# Altium schematic sheet 显示与输入.SchDoc
size A3
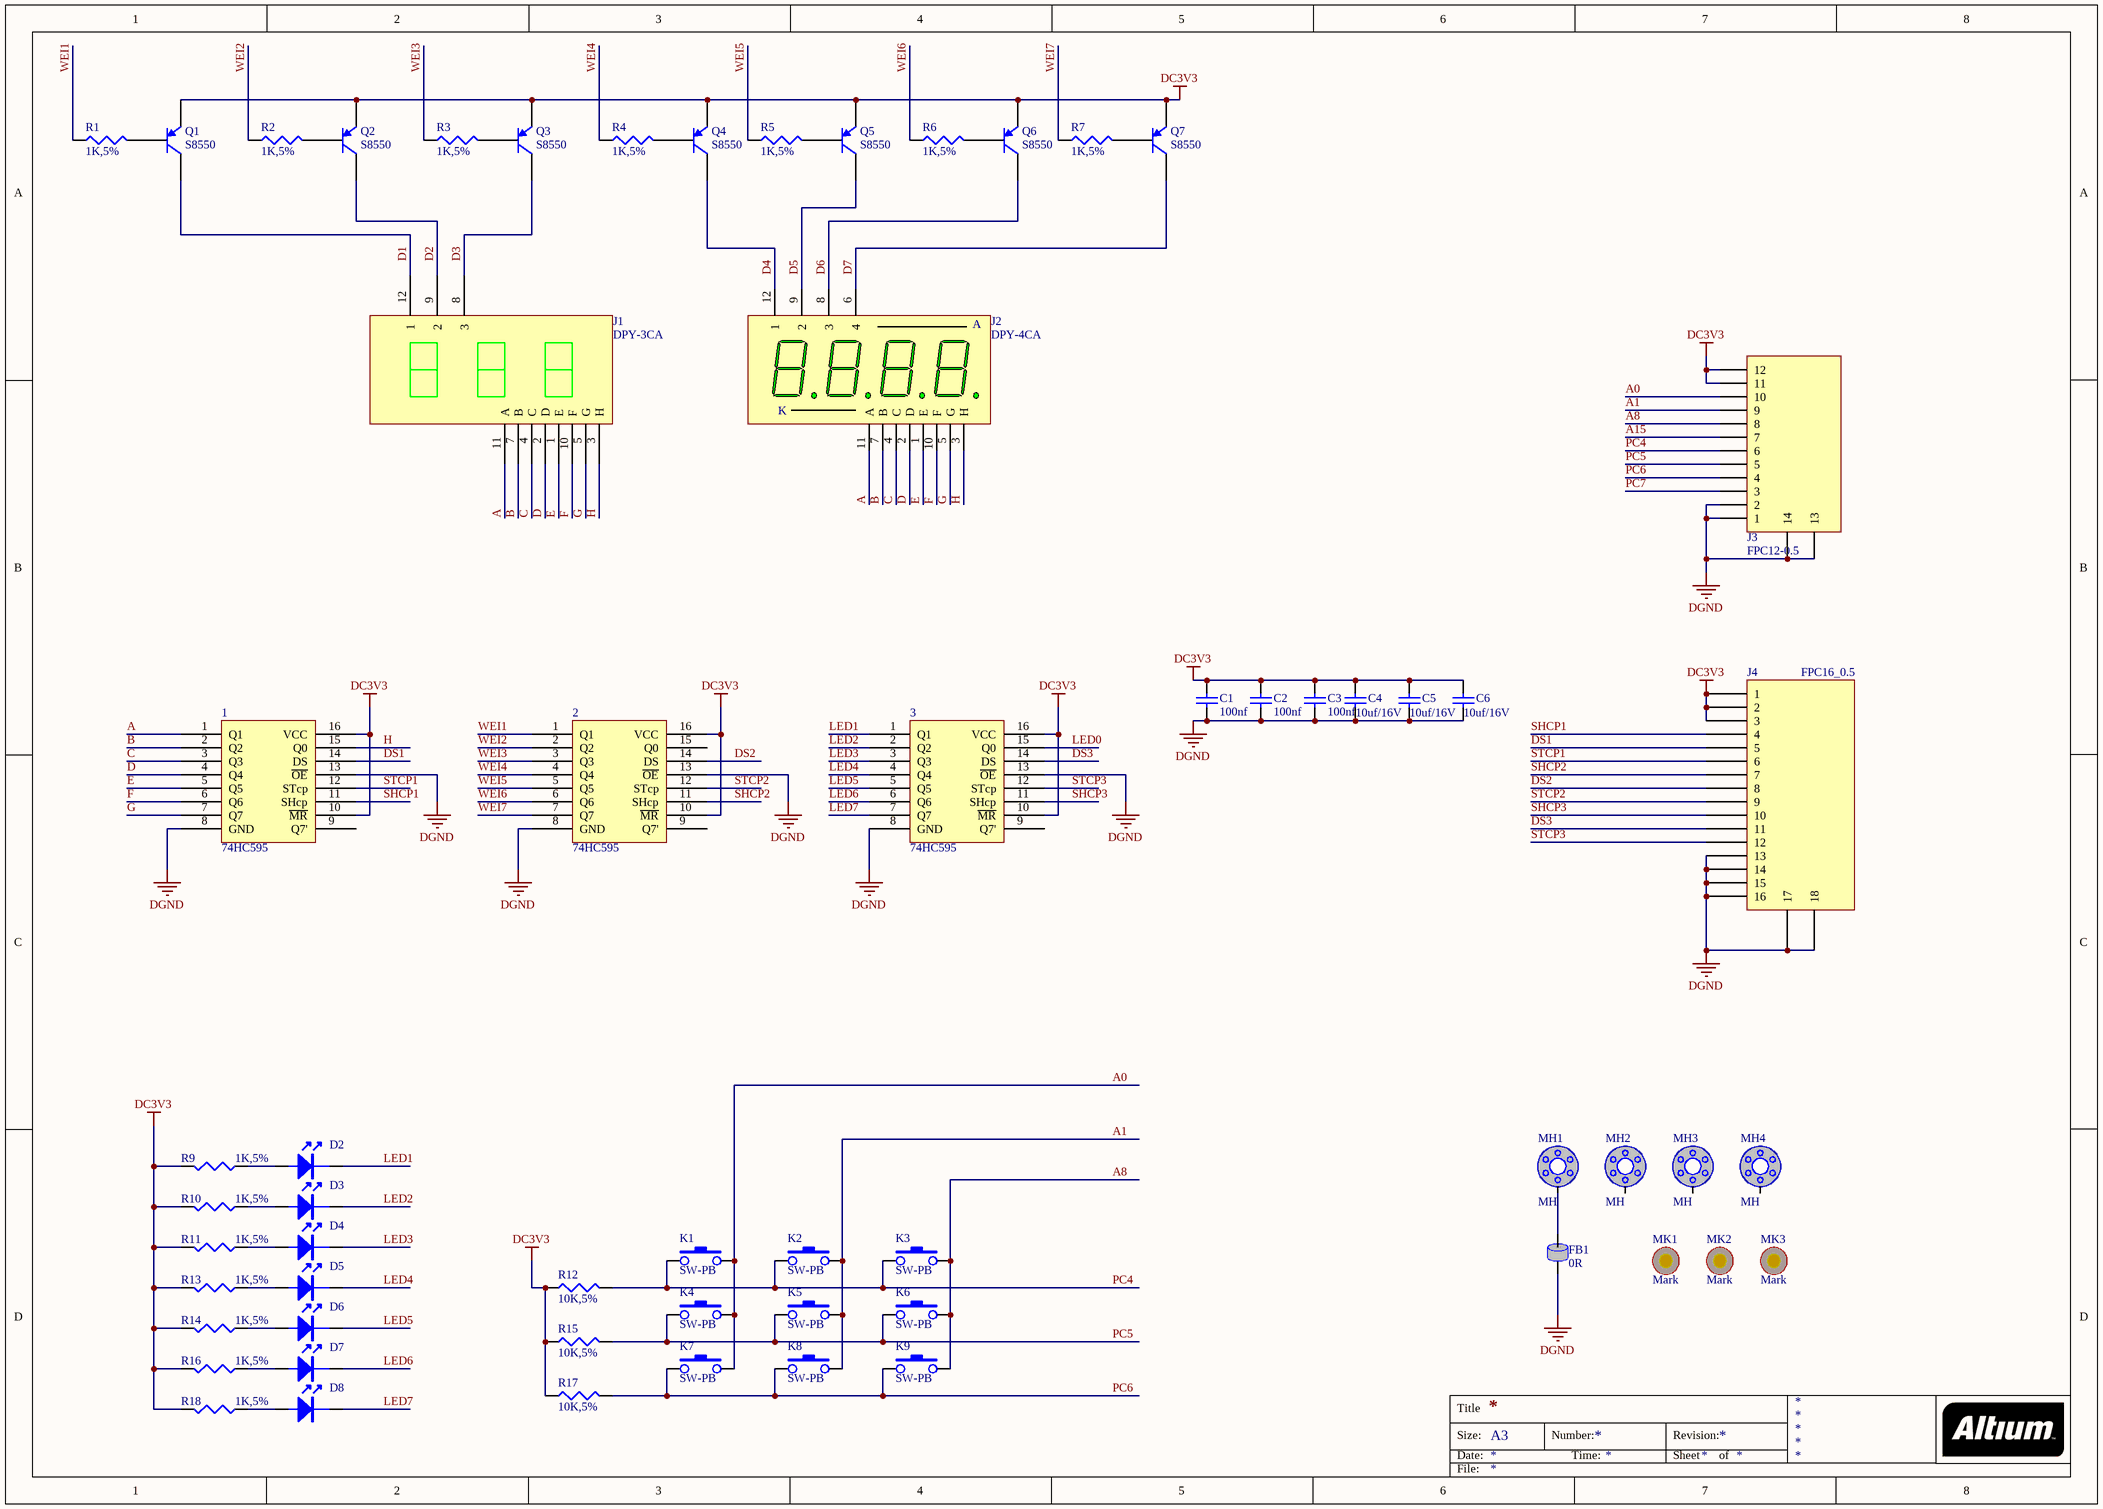
[diagram p0: 显示与输入.SchDoc]

## Parts
1  74HC595  [SOIC-16]
2  74HC595  [SOIC-16]
3  74HC595  [SOIC-16]
C1  100nf  [Cap0603]
C2  100nf  [Cap0603]
C3  100nf  [Cap0603]
C4  10uf/16V  [Cap0603]
C5  10uf/16V  [Cap0603]
C6  10uf/16V  [Cap0603]
D2  LED  [LED0603]  (value not drawn)
D3  LED  [LED0603]  (value not drawn)
D4  LED  [LED0603]  (value not drawn)
D5  LED  [LED0603]  (value not drawn)
D6  LED  [LED0603]  (value not drawn)
D7  LED  [LED0603]  (value not drawn)
D8  LED  [LED0603]  (value not drawn)
FB1  0R  [FB0603]
J1  DPY-3CA  [3位数码管0.56寸]
J2  DPY-4CA  [4位数码管0.56寸]
J3  FPC12-0.5  [FPC0.5-12P]
J4  FPC16_0.5  [FPC0.5-16P]
K1  SW-PB  [PCB-KEY]
K2  SW-PB  [PCB-KEY]
K3  SW-PB  [PCB-KEY]
K4  SW-PB  [PCB-KEY]
K5  SW-PB  [PCB-KEY]
K6  SW-PB  [PCB-KEY]
K7  SW-PB  [PCB-KEY]
K8  SW-PB  [PCB-KEY]
K9  SW-PB  [PCB-KEY]
MH1  MH  [AS_D3mm-6mm]
MH2  MH  [AS_D3mm-6mm]
MH3  MH  [AS_D3mm-6mm]
MH4  MH  [AS_D3mm-6mm]
MK1  Mark  [MK]
MK2  Mark  [MK]
MK3  Mark  [MK]
Q1  S8550  [SOT-23B]
Q2  S8550  [SOT-23B]
Q3  S8550  [SOT-23B]
Q4  S8550  [SOT-23B]
Q5  S8550  [SOT-23B]
Q6  S8550  [SOT-23B]
Q7  S8550  [SOT-23B]
R1  1K,5%  [Res0603]
R2  1K,5%  [Res0603]
R3  1K,5%  [Res0603]
R4  1K,5%  [Res0603]
R5  1K,5%  [Res0603]
R6  1K,5%  [Res0603]
R7  1K,5%  [Res0603]
R9  1K,5%  [Res0603]
R10  1K,5%  [Res0603]
R11  1K,5%  [Res0603]
R12  10K,5%  [Res0603]
R13  1K,5%  [Res0603]
R14  1K,5%  [Res0603]
R15  10K,5%  [Res0603]
R16  1K,5%  [Res0603]
R17  10K,5%  [Res0603]
R18  1K,5%  [Res0603]

## Nets
DC3V3: 1.10(~{MR}) 1.16(VCC) 2.10(~{MR}) 2.16(VCC) 3.10(~{MR}) 3.16(VCC) C1.2 C2.2 C3.2 C4.2 C5.2 C6.2 J3.11 J3.12 J4.1 J4.2 J4.3 Q1.3(C) Q2.3(C) Q3.3(C) Q4.3(C) Q5.3(C) Q6.3(C) Q7.3(C) R9.1 R10.1 R11.1 R12.1 R13.1 R14.1 R15.1 R16.1 R17.1 R18.1
DGND: 1.8(GND) 1.13(~{OE}) 2.8(GND) 2.13(~{OE}) 3.8(GND) 3.13(~{OE}) C1.1 C2.1 C3.1 C4.1 C5.1 C6.1 FB1.1 J3.1 J3.2 J3.13 J3.14 J4.13 J4.14 J4.15 J4.16 J4.17 J4.18
A: 1.1(Q1) J1.11(A) J2.11(A)
A0: J3.10 K1.2 K4.2 K7.2
A1: J3.9 K2.2 K5.2 K8.2
A8: J3.8 K3.2 K6.2 K9.2
A15: J3.7
B: 1.2(Q2) J1.7(B) J2.7(B)
C: 1.3(Q3) J1.4(C) J2.4(C)
D: 1.4(Q4) J1.2(D) J2.2(D)
D1: J1.12(1) Q1.2(E)
D2: J1.9(2) Q2.2(E)
D3: J1.8(3) Q3.2(E)
D4: J2.12(1) Q4.2(E)
D5: J2.9(2) Q5.2(E)
D6: J2.8(3) Q6.2(E)
D7: J2.6(4) Q7.2(E)
DS1: 1.14(DS) J4.5
DS2: 2.14(DS) J4.8
DS3: 3.14(DS) J4.11
E: 1.5(Q5) J1.1(E) J2.1(E)
F: 1.6(Q6) J1.10(F) J2.10(F)
G: 1.7(Q7) J1.5(G) J2.5(G)
H: 1.15(Q0) J1.3(H) J2.3(H)
LED0: 3.15(Q0)
LED1: 3.1(Q1) D2.K
LED2: 3.2(Q2) D3.K
LED3: 3.3(Q3) D4.K
LED4: 3.4(Q4) D5.K
LED5: 3.5(Q5) D6.K
LED6: 3.6(Q6) D7.K
LED7: 3.7(Q7) D8.K
PC4: J3.6 K1.1 K2.1 K3.1 R12.2
PC5: J3.5 K4.1 K5.1 K6.1 R15.2
PC6: J3.4 K7.1 K8.1 K9.1 R17.2
PC7: J3.3
SHCP1: 1.11(SHcp) J4.4
SHCP2: 2.11(SHcp) J4.7
SHCP3: 3.11(SHcp) J4.10
STCP1: 1.12(STcp) J4.6
STCP2: 2.12(STcp) J4.9
STCP3: 3.12(STcp) J4.12
WEI1: 2.1(Q1) R1.1
WEI2: 2.2(Q2) R2.1
WEI3: 2.3(Q3) R3.1
WEI4: 2.4(Q4) R4.1
WEI5: 2.5(Q5) R5.1
WEI6: 2.6(Q6) R6.1
WEI7: 2.7(Q7) R7.1
NetD2_A: D2.A R9.2
NetD3_A: D3.A R10.2
NetD4_A: D4.A R11.2
NetD5_A: D5.A R13.2
NetD6_A: D6.A R14.2
NetD7_A: D7.A R16.2
NetD8_A: D8.A R18.2
NetFB1_2: FB1.2 MH1.MH1
NetQ1_1: Q1.1(B) R1.2
NetQ2_1: Q2.1(B) R2.2
NetQ3_1: Q3.1(B) R3.2
NetQ4_1: Q4.1(B) R4.2
NetQ5_1: Q5.1(B) R5.2
NetQ6_1: Q6.1(B) R6.2
NetQ7_1: Q7.1(B) R7.2

Not connected (* = marked no-connect by the designer): 1 9(Q7'); 2 9(Q7') 15(Q0); 3 9(Q7'); MH2 MH1; MH3 MH1; MH4 MH1

## Notes on the sheet
- Title
- Size:
- Date:
- A3
- Number:
- Time:
- Revision:
- Sheet
- of
- File:
- (in symbol DPY-4CA) K

## Library data of the parts
C1-C6 = Cap Semi: 无极性电容（表贴）
FB1 = FerriteBead: 磁珠
J1 = DPY-3CA: 共阳3位数码管
J2 = DPY-4CA: 共阳4位数码管
MH1-MH4 = MH: 固定孔
MK1-MK3 = Mark: 贴片马克点
Q1-Q7 = S8550: PNP
R1-R7 R9-R18 = Res: 电阻